# Altium schematic sheet Dip_Switch.SchDoc
size A4; SheetNumber: 7; SheetTotal: 12
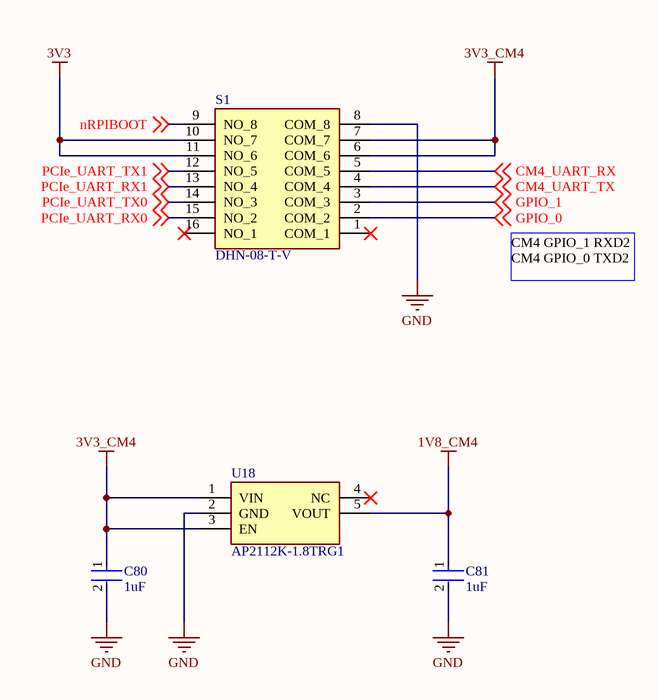
[diagram p0: Dip_Switch.SchDoc]

## Parts
C80  1uF  [FP-CC0805-0_85-MFG]
C81  1uF  [FP-CC0805-0_85-MFG]
S1  DHN-08-T-V  [DHN08TV]
U18  AP2112K-1.8TRG1  [SOT95P285X140-5N]

## Nets
1V8_CM4: C81.1 U18.5(VOUT)
3V3: S1.10(NO_7) S1.11(NO_6)
3V3_CM4: C80.1 S1.6(COM_6) S1.7(COM_7) U18.1(VIN) U18.3(EN)
GND: C80.2 C81.2 S1.8(COM_8) U18.2(GND)
CM4_UART_RX: S1.5(COM_5) ; off-sheet CM4_UART_RX
CM4_UART_TX: S1.4(COM_4) ; off-sheet CM4_UART_TX
GPIO_0: S1.2(COM_2) ; off-sheet GPIO_0
GPIO_1: S1.3(COM_3) ; off-sheet GPIO_1
nRPIBOOT: S1.9(NO_8) ; off-sheet nRPIBOOT
PCIe_UART_RX0: S1.15(NO_2) ; off-sheet PCIe_UART_RX0
PCIe_UART_RX1: S1.13(NO_4) ; off-sheet PCIe_UART_RX1
PCIe_UART_TX0: S1.14(NO_3) ; off-sheet PCIe_UART_TX0
PCIe_UART_TX1: S1.12(NO_5) ; off-sheet PCIe_UART_TX1

Not connected (* = marked no-connect by the designer): S1 1(COM_1)* 16(NO_1)*; U18 4(NC)*

## Notes on the sheet
- CM4 GPIO_1 RXD2
  CM4 GPIO_0 TXD2

## Library data of the parts
C80 C81 = CMP-03422-000182-1: CAP CER 1UF 10V X7R 0805; Manufacturer: Yageo; Manufacturer Part Number: CC0805KKX7R6BB105; Material: Ceramic; Tolerance: 0.1; Value: 1 uF; ComponentLink2URL: http://www.yageo.com/documents/recent/UPY-GPHC_Y5V_6.3V-to-50V_8.pdf; Automotive: No; Temperature Range Low: -30°C; Octopart: https://octopart.com/cc0805kkx7r6bb105-yageo-42522859; Temperature Characteristic: X7R; RoHS: TRUE; Voltage Rating: 10 V; Capacitance: 1 uF; Package: CC0805-0.85; Device Class L3: Ceramic Capacitors; Category: Cap; Mouser Description: Multilayer Ceramic Capacitors MLCC - SMD/SMT 1.0uF 10V X7R 10%; Temperature Range High: +85°C; Ipc Land Pattern Name: CAPC200125X85; ComponentLink2Description: Datasheet; Temperature: -30°C to +85°C; Height: 0.95mm; Lead Free: Yes; Device Class L1: Passive Components; Device Class L2: Capacitors; Footprint Url: http://www.yageo.com/exep/pages/download/literatures/UPY-C_GEN_24.pdf; Digikey Description: CAP CER 1UF 10V X7R 0805
S1 = DHN-08-T-V: Switch; Manufacturer_Name: Diptronics; Datasheet Link: https://componentsearchengine.com/Datasheets/1/DHN-08-T-V.pdf; Height: 1.65mm; Manufacturer_Part_Number: DHN-08-T-V; Mouser Part Number: 113-DHN-08-T-V; Mouser Price/Stock: https://www.mouser.com/Search/Refine.aspx?Keyword=113-DHN-08-T-V
U18 = AP2112K-1.8TRG1: Integrated Circuit; Manufacturer_Name: Diodes Inc.; Datasheet Link: https://www.diodes.com/assets/Datasheets/AP2112.pdf; Height: 1.4mm; Manufacturer_Part_Number: AP2112K-1.8TRG1; Mouser Part Number: 621-AP2112K-1.8TRG1; Mouser Price/Stock: https://www.mouser.co.uk/ProductDetail/Diodes-Incorporated/AP2112K-1.8TRG1?qs=x6A8l6qLYDBx1xhw8AX2cw%3D%3D; Arrow Part Number: AP2112K-1.8TRG1; Arrow Price/Stock: https://www.arrow.com/en/products/ap2112k-1.8trg1/diodes-incorporated?region=nac